# EAGLE design smb-breakout (EAGLE 5.10)
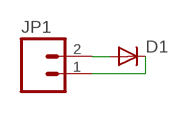
[diagram p0: schematic, sheet 1]

## Parts
D1  DIODESMB  [SMB-DIODE]
JP1  M02LOCK_LONGPADS  [1X02_LOCK_LONGPADS]

## Nets
ANODE: D1.A JP1.2
CATHODE: D1.C JP1.1

## Library data of the parts
D1 = SparkFun:DIODE: Diode These are standard reverse protection diodes and small signal diodes. SMA package can handle up to about 1A. SOD-323 can handle about 200mA. What the SOD-323 package when ordering, there are some mfgs out there that are 5-pin packages.
JP1 = SparkFun:M02: Header 2 Standard 2-pin 0.1" header. Use with straight break away headers (SKU : PRT-00116), right angle break away headers (PRT-00553), swiss pins (PRT-00743), machine pins (PRT-00117), and female headers (PRT-00115). Molex polarized connector foot print use with SKU : PRT-08233 with associated crimp pins and housings.

## Board
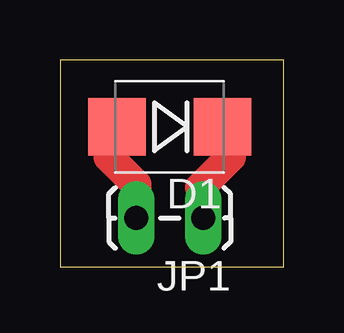
[diagram p1: board, top side]

Size 9.32 x 8.63 mm. Coordinates in mm from the lower left corner, seen from the top.
Outline: 0,0 9.32,0 9.32,8.63 0,8.63 0,0
Copper layers (1*16): Top 0.035mm / dielectric 1.5mm / Bottom 0.035mm
Design rules "default": minimum track width 10mil, minimum drill 24mil, track to track 8mil, track to pad 8mil, pad to pad 8mil, via to via 8mil, smd to smd 8mil, copper to edge 40mil, drill to drill 8mil, minimum pad ring 10mil, minimum via ring 8mil, stop-mask expansion 4mil, vias tented up to drill 0mil, thermal gap 10mil

### Footprints (pad centres in the part's own frame; a part is rotated, then mirrored left to right if it is on the bottom)
SMB-DIODE = smd 2.4 x 2.4: A 2.2,0; C -2.2,0
1X02_LOCK_LONGPADS = drill 1.016 long: 1 -0.127,0; 2 2.667,0

### Placement (x,y rotation side)
D1  4.57,5.84 180 top
JP1  5.84,2.03 180 top

### Tracks (layer width: path | path; a pad name or v marks a point on that pad's centre or on a via)
ANODE
  Top 1.27: JP1.2 3.17,3.43 2.03,4.57 2.03,5.5 D1.A
CATHODE
  Top 1.27: JP1.1 5.97,3.17 5.84,3.3 7.11,4.57 7.11,5.5 D1.C